# Altium schematic sheet FPGA Config GPMC.SchDoc: Cart
size Tabloid; ApprovedBy: NA; CompanyName: Cospan Design LLC; DrawnBy: David McCoy; Engineer: David McCoy; DocumentNumber: 12; Revision: A; SheetNumber: 12; SheetTotal: 18; Client: OSH; Project: Guppy Buddy; ProjectPrettyName: Guppy Buddy
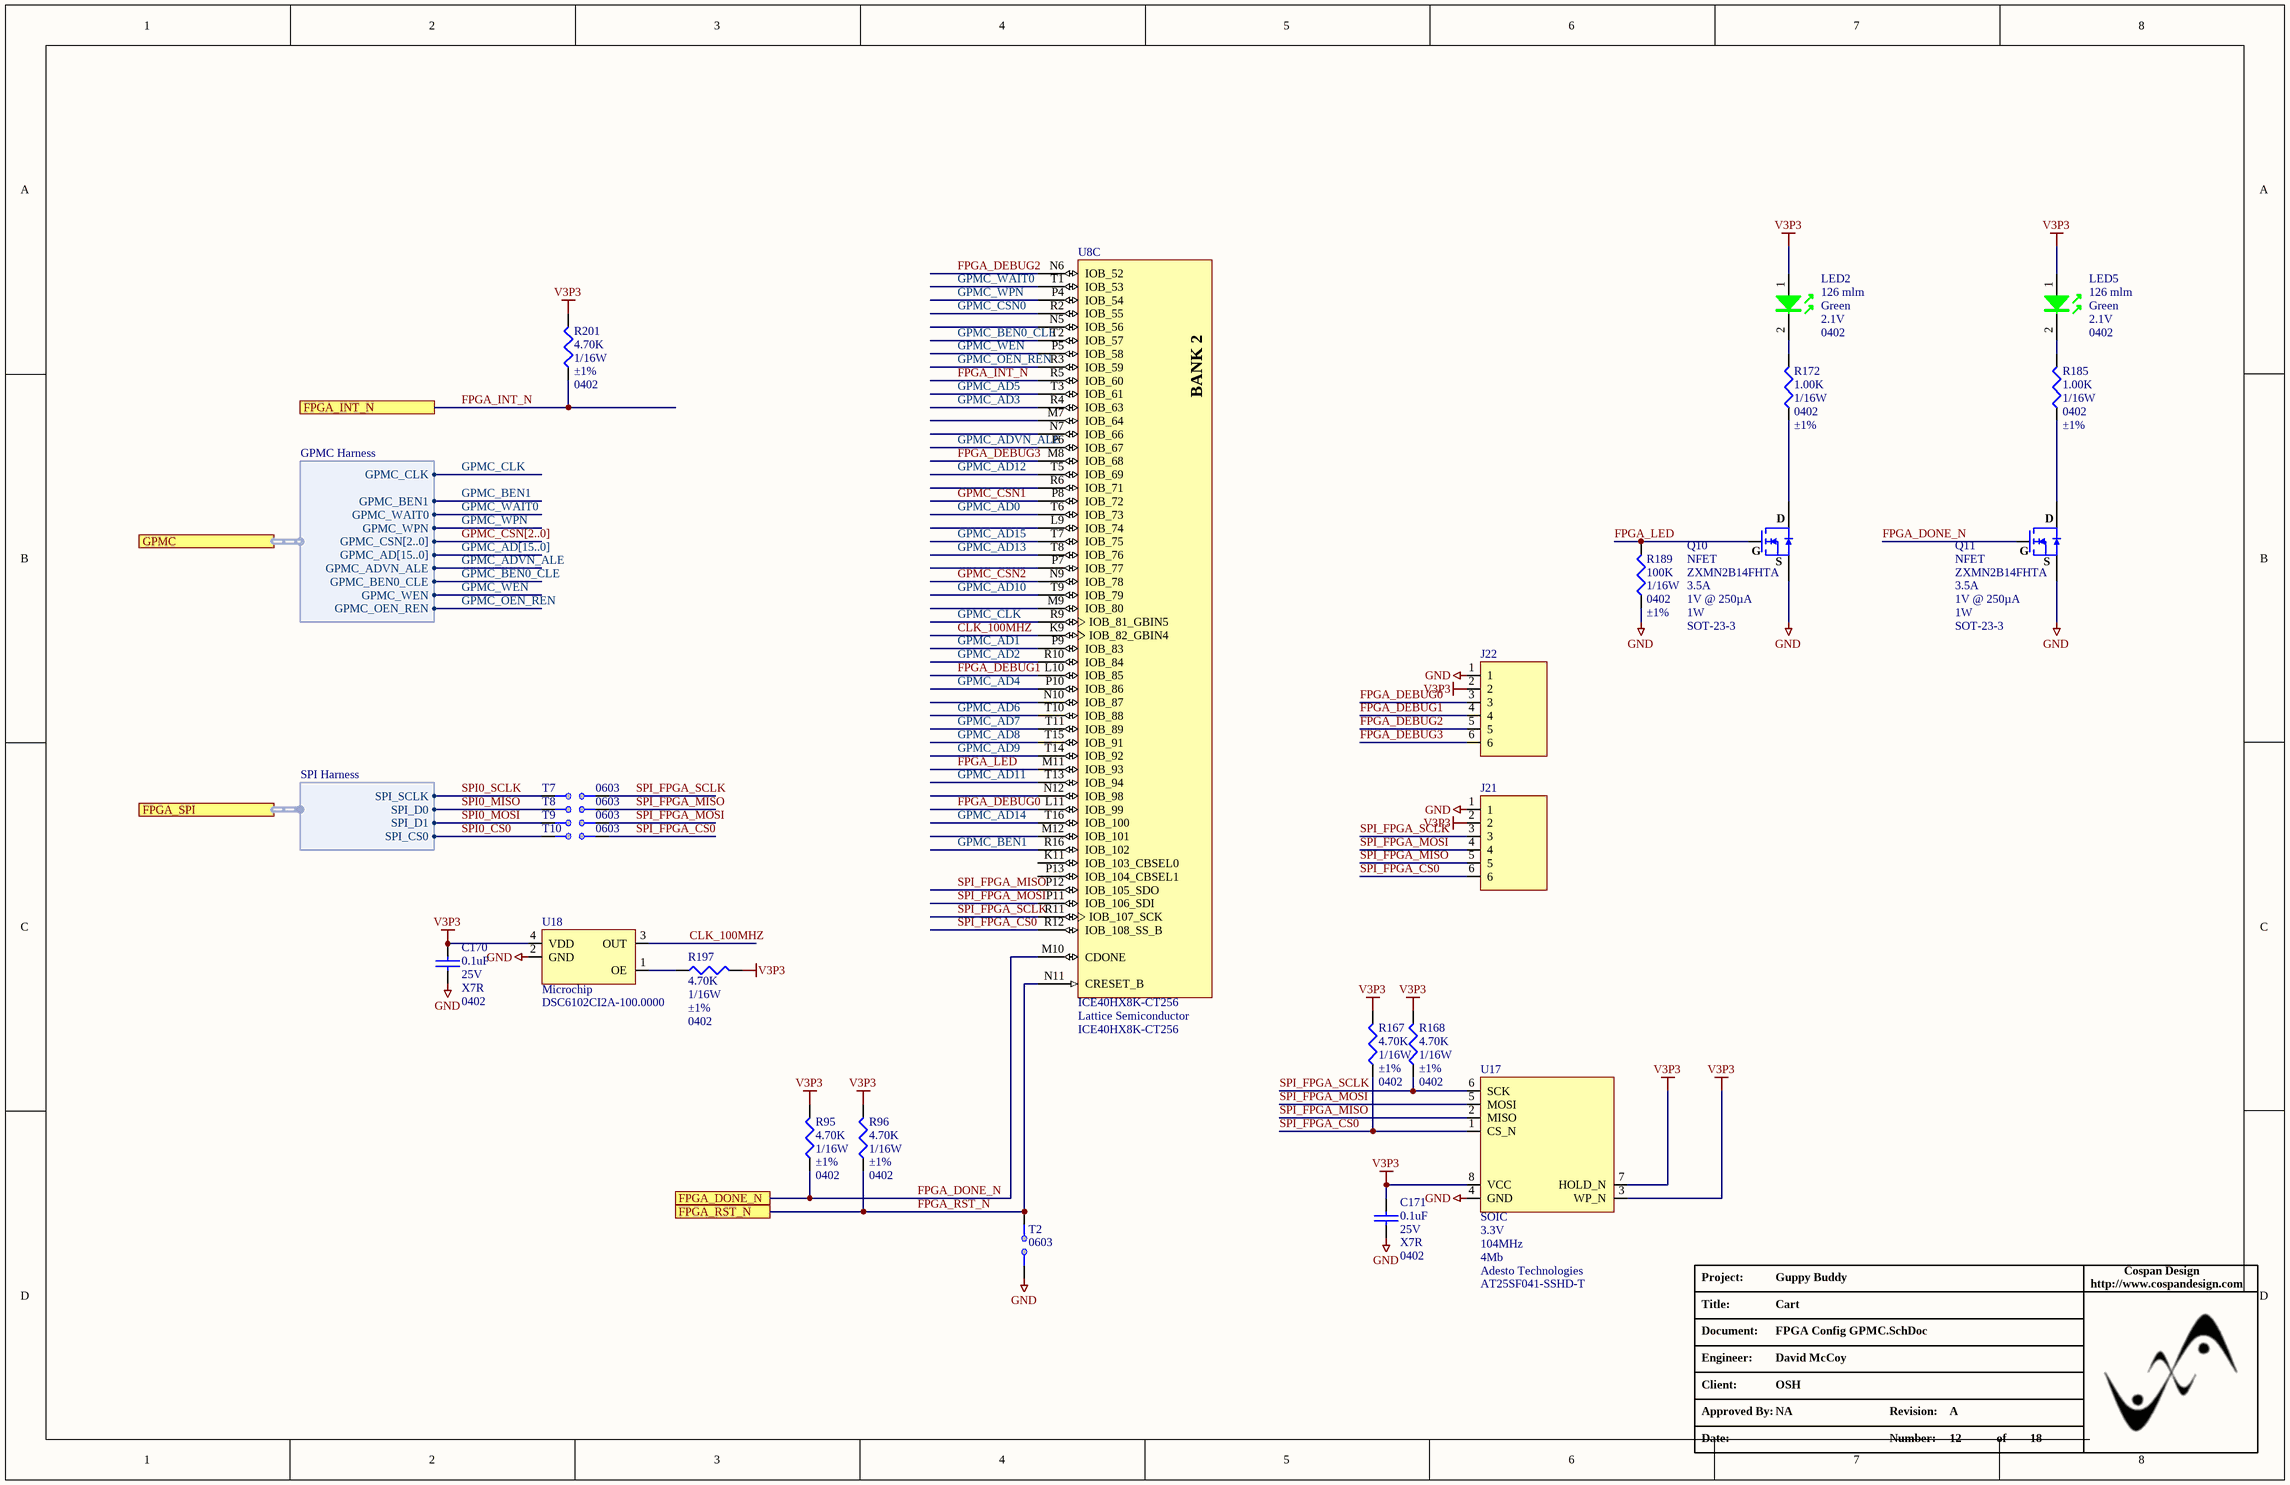
[diagram p0: FPGA Config GPMC.SchDoc]

## Parts
C170  Capacitance: 0.1uF  Voltage - Rated: 25V  Temperature Coefficient: X7R  Package / Case: 0402  [C_0402]  (hidden comment: C_0402_0.1UF_25V)
C171  Capacitance: 0.1uF  Voltage - Rated: 25V  Temperature Coefficient: X7R  Package / Case: 0402  [C_0402]  (hidden comment: C_0402_0.1UF_25V)
J21  J_HDR_1X6_HOLES  [HDR_1X6 _HOLES]  (value not drawn)  (no BOM)
J22  J_HDR_1X6_HOLES  [HDR_1X6 _HOLES]  (value not drawn)  (no BOM)
LED2  Luminous Flux @ Current - Test: 126 mlm  Color: Green  Voltage - Forward (Vf) Typ: 2.1V  Package / Case: 0402  [DIOM1005X07L_GREEN]  (hidden comment: LED_GRN_0402)
LED5  Luminous Flux @ Current - Test: 126 mlm  Color: Green  Voltage - Forward (Vf) Typ: 2.1V  Package / Case: 0402  [DIOM1005X07L_GREEN]  (hidden comment: LED_GRN_0402)
Q10  NFET  Manufacturer Part Number: ZXMN2B14FHTA  Current - Continuous Drain (Id) @ 25° C: 3.5A  Vgs(th) (Max) @ Id: 1V @ 250µA  Power - Max: 1W  Package / Case: SOT-23-3  [SOT-23A]
Q11  NFET  Manufacturer Part Number: ZXMN2B14FHTA  Current - Continuous Drain (Id) @ 25° C: 3.5A  Vgs(th) (Max) @ Id: 1V @ 250µA  Power - Max: 1W  Package / Case: SOT-23-3  [SOT-23A]
R95  Resistance In Ohms: 4.70K  Power (Watts): 1/16W  Tolerance: ±1%  Case: 0402  [R_0402]  (hidden comment: 4.7k Ohms)
R96  Resistance In Ohms: 4.70K  Power (Watts): 1/16W  Tolerance: ±1%  Case: 0402  [R_0402]  (hidden comment: 4.7k Ohms)
R167  Resistance In Ohms: 4.70K  Power (Watts): 1/16W  Tolerance: ±1%  Case: 0402  [R_0402]  (hidden comment: 4.7k Ohms)
R168  Resistance In Ohms: 4.70K  Power (Watts): 1/16W  Tolerance: ±1%  Case: 0402  [R_0402]  (hidden comment: 4.7k Ohms)
R172  Resistance In Ohms: 1.00K  Power (Watts): 1/16W  Case: 0402  Tolerance: ±1%  [R_0402]  (hidden comment: 1.0k Ohms)
R185  Resistance In Ohms: 1.00K  Power (Watts): 1/16W  Case: 0402  Tolerance: ±1%  [R_0402]  (hidden comment: 1.0k Ohms)
R189  Resistance In Ohms: 100K  Power (Watts): 1/16W  Case: 0402  Tolerance: ±1%  [R_0402]  (hidden comment: R_0402_100.0K)
R197  Resistance In Ohms: 4.70K  Power (Watts): 1/16W  Tolerance: ±1%  Case: 0402  [R_0402]  (hidden comment: 4.7k Ohms)
R201  Resistance In Ohms: 4.70K  Power (Watts): 1/16W  Tolerance: ±1%  Case: 0402  [R_0402]  (hidden comment: 4.7k Ohms)
T2  Case: 0603  [ERA-0603-SOLDER_JUMPER]  (hidden comment: Place Solder Bridge to Enable)  (no BOM)
T7  Case: 0603  [ERA-0603-SOLDER_JUMPER]  (hidden comment: Place Solder Bridge to Enable)  (no BOM)
T8  Case: 0603  [ERA-0603-SOLDER_JUMPER]  (hidden comment: Place Solder Bridge to Enable)  (no BOM)
T9  Case: 0603  [ERA-0603-SOLDER_JUMPER]  (hidden comment: Place Solder Bridge to Enable)  (no BOM)
T10  Case: 0603  [ERA-0603-SOLDER_JUMPER]  (hidden comment: Place Solder Bridge to Enable)  (no BOM)
U8  ICE40HX8K-CT256  Manufacturer 1: Lattice Semiconductor  [LATC-caBGA-256]  (part C of 5)
U17  Case/Package: SOIC  Operating Supply Voltage: 3.3V  Max Frequency: 104MHz  Density: 4Mb  Manufacturer 1: Adesto Technologies  Manufacturer Part Number 1: AT25SF041-SSHD-T  [SOIC-8]  (hidden comment: U_AT25SF041-SSHD-T)
U18  Manufacturer 1: Microchip  Manufacturer Part Number 1: DSC6102CI2A-100.0000  [4-SMD OSC]  (hidden comment: U_DSC6102CI2A-100.0000)

## Ports
FPGA_DONE_N, FPGA_INT_N, FPGA_RST_N, FPGA_SPI (harness SPI Harness), GPMC (harness GPMC Harness)

## Harnesses
GPMC Harness: GPMC_CLK, GPMC_BEN1, GPMC_WAIT0, GPMC_WPN, GPMC_CSN[2..0], GPMC_AD[15..0], GPMC_ADVN_ALE, GPMC_BEN0_CLE, GPMC_WEN, GPMC_OEN_REN
SPI Harness: SPI_SCLK, SPI_D0, SPI_D1, SPI_CS0

## Nets
GND: C170.1 C171.1 J21.1 J22.1 Q10.2(S) Q11.2(S) R189.2 T2.2 U17.4(GND) U18.2(GND)
V3P3: C170.2 C171.2 J21.2 J22.2 LED2.1 LED5.1 R95.1 R96.1 R167.1 R168.1 R197.1 R201.1 U17.3(WP_N) U17.7(HOLD_N) U17.8(VCC) U18.4(VDD)
CLK_100MHZ: U8.K9(IOB_82_GBIN4) U18.3(OUT)
FPGA_DEBUG0: J22.3 U8.L11(IOB_99)
FPGA_DEBUG1: J22.4 U8.L10(IOB_85)
FPGA_DEBUG2: J22.5 U8.N6(IOB_52)
FPGA_DEBUG3: J22.6 U8.M8(IOB_68)
FPGA_DONE_N: Q11.1(G) R95.2 U8.M10(CDONE) ; port FPGA_DONE_N
FPGA_INT_N: R201.2 U8.R5(IOB_60) ; port FPGA_INT_N
FPGA_LED: Q10.1(G) R189.1 U8.M11(IOB_93)
FPGA_RST_N: R96.2 T2.1 U8.N11(CRESET_B) ; port FPGA_RST_N
GPMC_AD0: U8.T6(IOB_73)
GPMC_AD1: U8.P9(IOB_83)
GPMC_AD2: U8.R10(IOB_84)
GPMC_AD3: U8.R4(IOB_63)
GPMC_AD4: U8.P10(IOB_86)
GPMC_AD5: U8.T3(IOB_61)
GPMC_AD6: U8.T10(IOB_88)
GPMC_AD7: U8.T11(IOB_89)
GPMC_AD8: U8.T15(IOB_91)
GPMC_AD9: U8.T14(IOB_92)
GPMC_AD10: U8.T9(IOB_79)
GPMC_AD11: U8.T13(IOB_94)
GPMC_AD12: U8.T5(IOB_69)
GPMC_AD13: U8.T8(IOB_76)
GPMC_AD14: U8.T16(IOB_100)
GPMC_AD15: U8.T7(IOB_75)
GPMC_ADVN_ALE: U8.P6(IOB_67) ; port GPMC.GPMC_ADVN_ALE
GPMC_BEN0_CLE: U8.T2(IOB_57) ; port GPMC.GPMC_BEN0_CLE
GPMC_BEN1: U8.R16(IOB_102) ; port GPMC.GPMC_BEN1
GPMC_CLK: U8.R9(IOB_81_GBIN5) ; port GPMC.GPMC_CLK
GPMC_CSN0: U8.R2(IOB_55)
GPMC_CSN1: U8.P8(IOB_72)
GPMC_CSN2: U8.N9(IOB_78)
GPMC_OEN_REN: U8.R3(IOB_59) ; port GPMC.GPMC_OEN_REN
GPMC_WAIT0: U8.T1(IOB_53) ; port GPMC.GPMC_WAIT0
GPMC_WEN: U8.P5(IOB_58) ; port GPMC.GPMC_WEN
GPMC_WPN: U8.P4(IOB_54) ; port GPMC.GPMC_WPN
SPI0_CS0: T10.1 ; port FPGA_SPI.SPI_CS0
SPI0_MISO: T8.1 ; port FPGA_SPI.SPI_D0
SPI0_MOSI: T9.1 ; port FPGA_SPI.SPI_D1
SPI0_SCLK: T7.1 ; port FPGA_SPI.SPI_SCLK
SPI_FPGA_CS0: J21.6 R167.2 T10.2 U8.R12(IOB_108_SS_B) U17.1(CS_N)
SPI_FPGA_MISO: J21.5 T8.2 U8.P12(IOB_105_SDO) U17.2(MISO)
SPI_FPGA_MOSI: J21.4 T9.2 U8.P11(IOB_106_SDI) U17.5(MOSI)
SPI_FPGA_SCLK: J21.3 R168.2 T7.2 U8.R11(IOB_107_SCK) U17.6(SCK)
NetLED2_2: LED2.2 R172.1
NetLED5_2: LED5.2 R185.1
NetQ10_3: Q10.3(D) R172.2
NetQ11_3: Q11.3(D) R185.2
NetR197_2: R197.2 U18.1(OE)

Not connected (* = marked no-connect by the designer): U8 K11(IOB_103_CBSEL0) L9(IOB_74) M7(IOB_64) M9(IOB_80) M12(IOB_101) N5(IOB_56) N7(IOB_66) N10(IOB_87) N12(IOB_98) P7(IOB_77) P13(IOB_104_CBSEL1) R6(IOB_71)

## Buses and harness runs
bus GPMC_AD[15..0]
bus GPMC_CSN[2..0]

## Notes on the sheet
- Project:
- http://www.cospandesign.com
- Cospan Design
- Document:
- Engineer:
- Title:
- Client:
- Approved By:
- Revision:
- Date:
- Number:
- of
- (in symbol U_ICE40HX8K-CT256, part C) BANK 2

## Library data of the parts
C170 C171 = C_0402_0.1UF_25V: CAP CER 0.1UF 25V X6S 0402; Manufacturer 1: Yageo; Manufacturer Part Number 1: CC0402KRX7R8BB104; Description 1: Cap Ceramic 0.1uF 25V X7R 10% SMD 0402 125C Paper T/R; Tolerance: 10%; Dissipation Factor: 3.5%; ComponentLink1URL: https://product.tdk.com/info/en/catalog/datasheets/mlcc_commercial_general_en.pdf; ComponentLink1Description: https://product.tdk.com/info/en/catalog/datasheets/mlcc_commercial_general_en.pdf; Supplier 1: Digi-Key; Supplier Part Number 1: 311-2077-1-ND; Stock 1: 0; Pricing 1: 1=0.1, 10=0.048, 100=0.0215, 500=0.01534, 1000=0.01205, 2500=0.01095, 5000=0.01007 (USD); Mount: Surface Mount; Case/Package: 0402; Case Code (Imperial): 0402; Case Code (Metric): 1005; Min Operating Temperature: -55°C; Max Operating Temperature: 125°C; Voltage Rating: 25V; Voltage Rating (DC): 25V; Packaging: Tape and Reel; Dielectric: X7R; Termination: SMD/SMT; Composition: Ceramic; Length: 1mm; Height: 0.5mm; Width: 0.02inch; Thickness: 0.022inch; Depth: 0.5mm; Radiation Hardening: No; Lead Free: Lead Free; Halogen Free: Halogen Free; ComponentLink2URL: https://datasheet.ciiva.com/11464/upy-gphc-x7r-6-3v-to-50v-8-11464889.pdf; ComponentLink2Description: https://datasheet.ciiva.com/11464/upy-gphc-x7r-6-3v-to-50v-8-11464889.pdf; ComponentLink3URL: https://datasheet.ciiva.com/13210/upy-gphc-x7r-6-3v-to-50v-8-12304-13210908.pdf; ComponentLink3Description: https://datasheet.ciiva.com/13210/upy-gphc-x7r-6-3v-to-50v-8-12304-13210908.pdf; ComponentLink4URL: https://datasheet.ciiva.com/17437/upy-gphc-x7r-6-3v-to-50v-8-17437357.pdf; ComponentLink4Description: https://datasheet.ciiva.com/17437/upy-gphc-x7r-6-3v-to-50v-8-17437357.pdf
J21 J22 = J_HDR_1X6_HOLES: 6 Holes
LED2 LED5 = LED_GRN_0402: LED 1X0.5MM 570NM GN WTR CLR SMD; Manufacturer: Kingbright Corp; Manufacturer Part Number: APHHS1005CGCK; Current - Test: 20mA; Wavelength - Peak: 574nm; Millicandela Rating: 40mcd; Lens Type: Clear; Lens Style/Size: Rectangle, 0.8mm x 0.5mm; Viewing Angle: 120°; Supplier 1: Digi-Key; Supplier Part Number 1: 754-1101-1-ND; RoHS: RoHS Compliant; Category: Optoelectronics; Stock 1: 3400; Pricing: 1=0.24, 10=0.176, 25=0.1412, 100=0.1293, 250=0.11752, 500=0.10576, 1000=0.094 (USD); Wavelength - Dominant: 570nm; Mounting Type: Surface Mount; Packaging: Cut Tape (CT); Size / Dimension: *; Height: *; ComponentLink1URL: http://www.us.kingbright.com/images/catalog/SPEC/APHHS1005CGCK.pdf; ComponentLink1Description: http://www.us.kingbright.com/images/catalog/SPEC/APHHS1005CGCK.pdf
Q10 Q11 = Q_NFET_3.50A_SOT23: MOSFET N-CH 20V 3.5A SOT23-3; Manufacturer: Diodes Incorporated; FET Type: N-Channel; Rds On (Max) @ Id, Vgs: 55 mOhm @ 3.5A, 4.5V; Current - Continuous Drain (Id) @ 25°C: 3.5A (Ta); Drive Voltage (Max Rds On,  Min Rds On): 1.8V, 4.5V; Gate Charge (Qg) (Max) @ Vgs: 11nC @ 4.5V; Input Capacitance (Ciss) (Max) @ Vds: 872pF @ 10V; Vgs (Max): ±8V; Power Dissipation (Max): 1W (Ta); Supplier 1: Digi-Key; Supplier Part Number 1: ZXMN2B14FHCT-ND; RoHS: RoHS Compliant; Category: Discrete Semiconductor Products; Stock 1: 1379; FET Feature: -; Drain to Source Voltage (Vdss): 20V; Mounting Type: Surface Mount; Supplier Device Package: SOT-23-3; Packaging: Cut Tape (CT); ComponentLink1URL: http://www.diodes.com/_files/datasheets/ZXMN2B14FH.pdf; ComponentLink1Description: http://www.diodes.com/_files/datasheets/ZXMN2B14FH.pdf; Pricing 1: 1=0.78, 10=0.683, 100=0.5238, 500=0.41406, 1000=0.33125 (USD); Part Status: Active; Technology: MOSFET (Metal Oxide); Operating Temperature: -55°C ~ 150°C (TJ)
R95 R96 R167 R168 R197 R201 = R_0402_4.70K: RES 4.70K OHM 1/16W 1% 0402 SMD; Manufacturer: Yageo; Manufacturer Part Number: RC0402FR-074K7L; Temperature Coefficient: ±100ppm/°C; Supplier 1: Digi-Key; Supplier Part Number 1: 311-4.7KLRCT-ND; RoHS: RoHS Compliant; Category: Resistors; Stock 1: 3610; Pricing: 10=0.014, 100=0.0063, 500=0.00382, 1000=0.0027, 5000=0.00203 (USD); Resistance (Ohms): 4.7K; Composition: Thick Film; Features: -; Package / Case: 0402 (1005 Metric); Size / Dimension: 0.039" L x 0.020" W (1.00mm x 0.50mm); Height: 0.016" (0.40mm); Number of Terminations: 2; Packaging: Cut Tape (CT); ComponentLink1URL: http://www.yageo.com/documents/recent/PYu-RC0402_51_RoHS_L_6.pdf; ComponentLink1Description: http://www.yageo.com/documents/recent/PYu-RC0402_51_RoHS_L_6.pdf
R172 R185 = R_0402_1.0K: RES 1.00K OHM 1/16W 1% 0402 SMD; Manufacturer: Yageo; Manufacturer Part Number: RC0402FR-071KL; Resistance (Ohms): 1K; Temperature Coefficient: ±100ppm/°C; Supplier 1: Digi-Key; Supplier Part Number 1: 311-1.00KLRCT-ND; RoHS: RoHS Compliant; Category: Resistors; Stock 1: 2103351; Pricing: 10=0.014, 100=0.0063, 500=0.00382, 1000=0.0027, 5000=0.00203 (USD); Composition: Thick Film; Features: -; Package / Case: 0402 (1005 Metric); Size / Dimension: 0.039" L x 0.020" W (1.00mm x 0.50mm); Height: 0.016" (0.40mm); Number of Terminations: 2; Packaging: Cut Tape (CT); ComponentLink1URL: http://www.yageo.com/documents/recent/PYu-RC0402_51_RoHS_L_6.pdf; ComponentLink1Description: http://www.yageo.com/documents/recent/PYu-RC0402_51_RoHS_L_6.pdf
R189 = R_0402_100.0K: RES 100K OHM 1/16W 1% 0402 SMD; Manufacturer: Stackpole Electronics Inc; Manufacturer Part Number: RMCF0402FT100K; Temperature Coefficient: ±100ppm/°C; RoHS: RoHS Compliant; Category: Resistors; Composition: Thick Film; Features: -; Lead Style: Surface Mount (SMD - SMT); Packaging: Cut Tape (CT); Resistance (Ohms): 100k; Package / Case: 0402 (1005 Metric); Supplier Device Package: 0402; Size / Dimension: 0.039" L x 0.020" W (1.00mm x 0.50mm); Height: 0.016" (0.40mm); Number of Terminations: 2; Supplier 1: Digi-Key; Supplier Part Number 1: RMCF0402FT100KCT-ND; Stock 1: 18746; Pricing: 1=0.04, 10=0.025, 50=0.0138, 100=0.0105, 250=0.0078, 500=0.00576, 1000=0.00384, 2500=0.00324, 5000=0.0027 (USD); ComponentLink1URL: http://www.seielect.com/Catalog/SEI-RMCF_RMCP.pdf; ComponentLink1Description: http://www.seielect.com/Catalog/SEI-RMCF_RMCP.pdf
T2 T7-T10 = T_0603_JUMPER_PAD: SOLDER_JUMPER PAD
U8 = U_ICE40HX8K-CT256: iCE40 HX8K Series FPGA Family, 7680 Logic Cells, 1.2 V Core, 128 K Embedded RAM Bits, 256-ball caBGA, Pb-Free, Tray; Supply Voltage: 1.2V; Phase-Locked Loops: 2; Logic Cells: 7680; Embedded RAM Bits: 128K; Description 1: IC FPGA HX 7680LUTS 1.2V 256BGA; Density: 128Kb; Number of Logic Blocks (LABs): 960; Number of I/Os: 206; Min Supply Voltage: 1.14V; Max Supply Voltage: 1.26V; RAM Size: 131072b; Max Frequency: 533MHz; PackageReference: caBGA-256; PackageDescription: 256-Ball Chip Array Ball Grid Array, Body 14 x 14 mm, Pitch 0.8 mm; RoHS: TRUE; Packing: Tray; Mounting Technology: Surface Mount; ComponentLink3URL: http://www.latticesemi.com/lit/docs/package/pkg.pdf; ComponentLink1Description: Manufacturer URL; ComponentLink3Description: Package Specification; Code_JEDEC: MO-275; PackageVersion: Rev. 03.9, 02/2013; ComponentLink1URL: http://www.latticesemi.com/en; ComponentLink2URL: http://www.latticesemi.com/~/media/Documents/DataSheets/iCE/iCE40LPHXFamilyDataSheet.pdf; PartNumber: ICE40HX8K-CT256; Manufacturer: Lattice Semiconductor; ComponentLink2Description: Datasheet; DatasheetVersion: Rev. 02.9; Supplier 1: Digi-Key; Supplier Part Number 1: 220-1575-ND; Stock 1: 549; Pricing 1: 1=11.41, 25=9.898, 100=9.4536 (USD); Case/Package: BGA; Number of Pins: 256; Weight: 0.098203oz; Min Operating Temperature: -40°C; Max Operating Temperature: 85°C; Package Quantity: 119; Packaging: Tray; Operating Supply Voltage: 1.2V; Number of Gates: 7680; Number of Logic Elements/Cells: 7680; Memory Size: 128Kb; Number of Registers: 7680; Length: 14mm; Height: 17mm; Width: 14mm; Lead Free: Lead Free; ComponentLink4URL: http://www.mouser.com/ds/2/225/iCE40FamilyHandbook-311139.pdf; ComponentLink4Description: http://www.mouser.com/ds/2/225/iCE40FamilyHandbook-311139.pdf; Manufacturer Part Number 1: ICE40HX8K-CT256
U17 = U_AT25SF041-SSHD-T: Flash Mem Serial-SPI 3.3V 4Mbit 4M x 1bit 8-Pin SOIC T/R; Interface: Serial,SPI; Page Size: 256B; Max Supply Voltage: 3.6V; Min Supply Voltage: 2.5V; Memory Type: FLASH,NOR; Max Supply Current: 8mA; Data Bus Width: 8b; Access Time: 8ns; Description 1: Flash Mem Serial-SPI 3.3V 4Mbit 4M x 1bit 8-Pin SOIC T/R; Stock 1: 106462; Mount: Surface Mount; Number of Pins: 8; Weight: 0.019048oz; Contact Plating: Gold; Min Operating Temperature: -40°C; Max Operating Temperature: 85°C; Packaging: Tape and Reel; Frequency: 104MHz; Memory Size: 4Mb; Package Quantity: 4000; Lead Free: Lead Free; Supplier 1: Digi-Key; Supplier Part Number 1: 1265-1131-6-ND; Pricing 1: 1=0.36 (USD)
U18 = U_DSC6102CI2A-100.0000: OSC MEMS 100.0000MHZ CMOS SMD; Description 1: OSC MEMS 100.0000MHZ CMOS SMD; Stock 1: 719; Supplier 1: Digi-Key; Supplier Part Number 1: DSC6102CI2A-100.0000-ND; Pricing 1: 1=0.92, 25=0.7624, 100=0.7339 (USD)